# Altium schematic sheet MCU_DigiPidCntlr.SchDoc
size A4
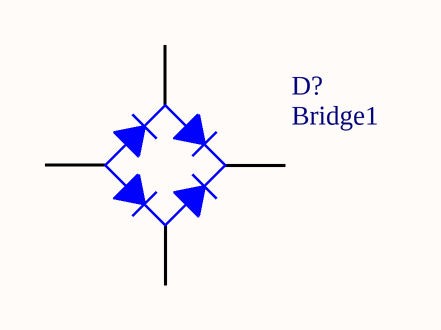
[diagram p0: MCU_DigiPidCntlr.SchDoc]

## Parts
D?  Bridge1  [D-38]

## Nets

Not connected (* = marked no-connect by the designer): D? 1(K) 2(C) 3(A) 4(C)

## Library data of the parts
D? = Bridge1: Full Wave Diode Bridge; Published: 8-Jun-2000; LatestRevisionDate: 29-May-2009; LatestRevisionNote: Sch pins A & K swapped.; DatasheetVersion: E2732B; PackageReference: D-38; Publisher: Altium Limited; PackageDescription: Bridge Rectifier; 4 Terminals; Body 9.4 x 9.4 mm (typ); Pitch 5.08 mm